# Altium schematic sheet pay-optical-toplevel.SchDoc: PAY Optical Top Level
size A4; DrawnBy: Dylan Vogel; Organization: UTAT SS; DocumentNumber: 1; Revision: 2; SheetNumber: 1; SheetTotal: 13
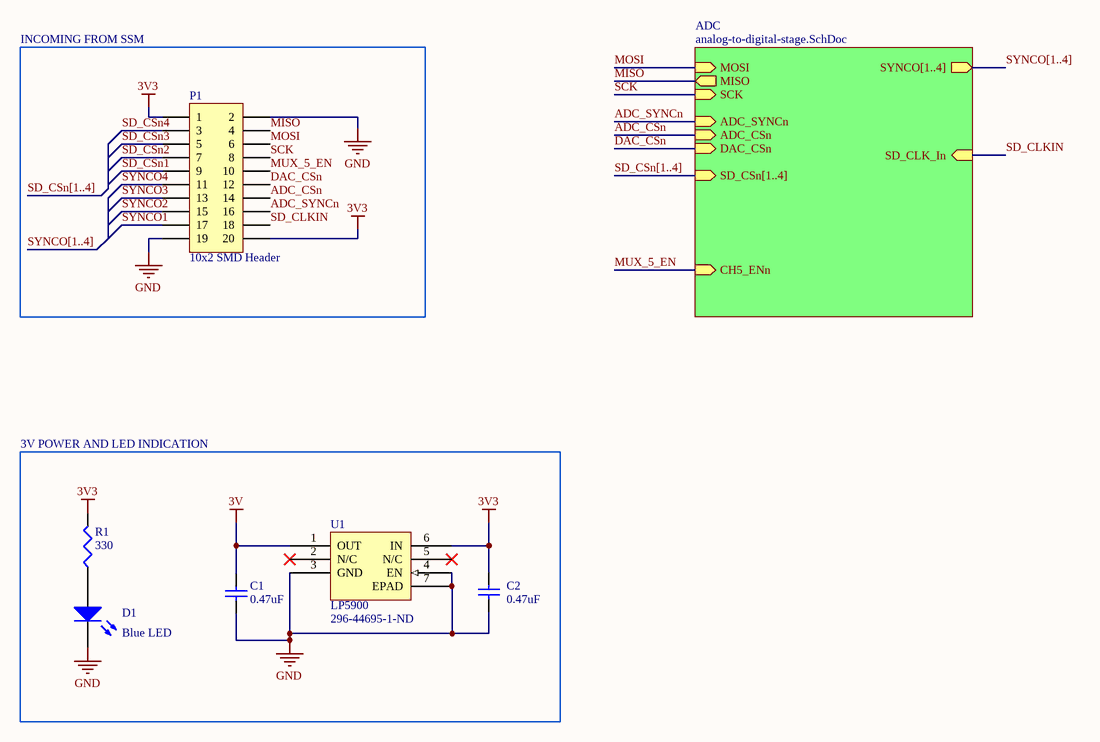
[diagram p0: pay-optical-toplevel.SchDoc]

## Parts
C1  0.47uF  [1608[0603]]
C2  0.47uF  [1608[0603]]
D1  Blue LED  [0603-LED]
P1  10x2 SMD Header  [CON20_2X10_DUA00]
R1  330  [0402]
U1  LP5900  Supplier Part Number 1: 296-44695-1-ND  [DFN220X250X80-7N]

## Blocks framed on the sheet
INCOMING FROM SSM: P1
3V POWER AND LED INDICATION: C1 C2 D1 R1 U1

## Sub-sheets
ADC = analog-to-digital-stage.SchDoc: SCK (in), MISO (out), MOSI (in), ADC_SYNCn (in), ADC_CSn (in), DAC_CSn (in), CH5_ENn (in), SD_CLK_In (in), SD_CSn[1..4] (in), SYNCO[1..4] (out)

## Nets
3V: C1.2 U1.1(OUT)
3V3: C2.2 P1.1 P1.20 R1.2 U1.6(IN)
GND: C1.1 C2.1 D1.2(K) P1.2 P1.19 U1.3(GND) U1.4(EN) U1.7(EPAD)
ADC_CSn: P1.14 ; sheet ADC/ADC_CSn
ADC_SYNCn: P1.16 ; sheet ADC/ADC_SYNCn
DAC_CSn: P1.12 ; sheet ADC/DAC_CSn
MISO: P1.4 ; sheet ADC/MISO
MOSI: P1.6 ; sheet ADC/MOSI
MUX_5_EN: P1.10 ; sheet ADC/CH5_ENn
SCK: P1.8 ; sheet ADC/SCK
SD_CLKIN: P1.18 ; sheet ADC/SD_CLK_In
SD_CSn1: P1.9
SD_CSn2: P1.7
SD_CSn3: P1.5
SD_CSn4: P1.3
SYNCO1: P1.17
SYNCO2: P1.15
SYNCO3: P1.13
SYNCO4: P1.11
NetD1_1: D1.1(A) R1.1

Not connected (* = marked no-connect by the designer): U1 2(N/C)* 5(N/C)*

## Buses and harness runs
bus SD_CSn[1..4]
bus SD_CSn[1..4] = sheet ADC/SD_CSn[1..4]
bus SYNCO[1..4]
bus SYNCO[1..4] = sheet ADC/SYNCO[1..4]

## Library data of the parts
C1 C2 = Cap Semi: Capacitor (Semiconductor SIM Model); Published: 8-Jun-2000; LatestRevisionDate: 29-May-2009; LatestRevisionNote: IPC-7351 Footprint Added.; PackageReference: C1206; Publisher: Altium Limited; PackageDescription: Chip Capacitor; Value: 0.47uF; Supplier: Digi-Key; Supplier 1: Digi-Key
D1 = LED2: Typical RED, GREEN, YELLOW, AMBER GaAs LED; Published: 8-Jun-2000; LatestRevisionDate: 17-Jul-2002; LatestRevisionNote: Re-released for DXP Platform.; PackageVersion: Feb-2002; PackageReference: 3.2X1.6X1.1; Publisher: Altium Limited; PackageDescription: SM LED; 2 Flat Leads; Supplier 1: Digi-Key
P1 = Header 10X2: 10x2 SMD 50mil Incoming from SSM; LatestRevisionDate: 17-Jul-2002; LatestRevisionNote: Re-released for DXP Platform.; Publisher: Altium Limited; Supplier 1: Digi-Key; Supplier Part Number 1: SAM11274-ND
R1 = Res3: Power indication LED; Published: 8-Jun-2000; LatestRevisionDate: 29-May-2009; LatestRevisionNote: IPC-7351 Footprint Added.; PackageReference: J1-0603; Publisher: Altium Limited; PackageDescription: Chip Resistor; Value: 330; Supplier 1: Digi-Key
U1 = LP5900: Low noise 3V low dropout regulator for analog and RF applications.; Supplier 1: Digi-Key